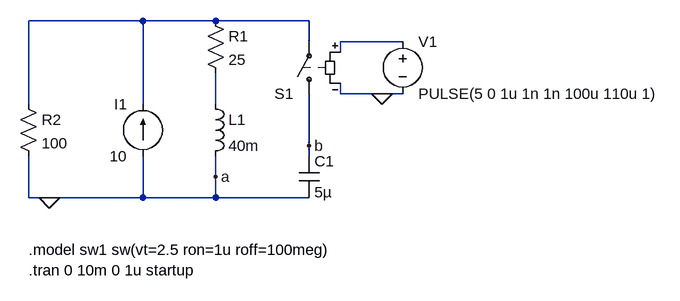
[diagram p0: schematic hw_2.asc]
hw_2.asc, the LTspice schematic file:
Version 4
SHEET 1 1024 680
WIRE 176 0 0 0
WIRE 288 0 176 0
WIRE 432 0 288 0
WIRE 432 32 432 0
WIRE 576 32 480 32
WIRE 480 48 480 32
WIRE 480 112 480 96
WIRE 544 112 480 112
WIRE 576 112 544 112
WIRE 0 128 0 0
WIRE 176 128 176 0
WIRE 288 128 288 80
WIRE 432 192 432 112
WIRE 432 208 432 192
WIRE 288 240 288 208
WIRE 0 272 0 208
WIRE 32 272 0 272
WIRE 176 272 176 208
WIRE 176 272 32 272
WIRE 288 272 288 240
WIRE 288 272 176 272
WIRE 432 272 288 272
FLAG 288 240 a
FLAG 432 192 b
FLAG 32 272 0
FLAG 544 112 0
SYMBOL current 176 208 R180
WINDOW 0 24 80 Left 2
WINDOW 3 24 0 Left 2
WINDOW 123 0 0 Left 0
WINDOW 39 0 0 Left 0
SYMATTR InstName I1
SYMATTR Value 10
SYMBOL ind 272 112 R0
SYMATTR InstName L1
SYMATTR Value 40m
SYMBOL res 272 -16 R0
SYMATTR InstName R1
SYMATTR Value 25
SYMBOL res -16 112 R0
SYMATTR InstName R2
SYMATTR Value 100
SYMBOL cap 416 208 R0
SYMATTR InstName C1
SYMATTR Value 5µ
SYMBOL sw 432 128 R180
SYMATTR InstName S1
SYMATTR Value ""
SYMATTR SpiceModel sw1
SYMBOL voltage 576 16 R0
WINDOW 123 0 0 Left 0
WINDOW 39 0 0 Left 0
SYMATTR InstName V1
SYMATTR Value PULSE(5 0 1u 1n 1n 100u 110u 1)
TEXT 0 352 Left 2 !.model sw1 sw(vt=2.5 ron=1u roff=100meg)
TEXT 0 384 Left 2 !.tran 0 10m 0 1u startup

The netlist it stands for:
* hw_2.asc
I1 0 N001 10
L1 N003 0 40m
R1 N001 N003 25
R2 N001 0 100
C1 b 0 5µ
S1 b N001 N002 0 sw1
V1 N002 0 PULSE(5 0 1u 1n 1n 100u 110u 1)
.model sw1 sw(vt=2.5 ron=1u roff=100meg)
.tran 0 10m 0 1u startup
.backanno
.end